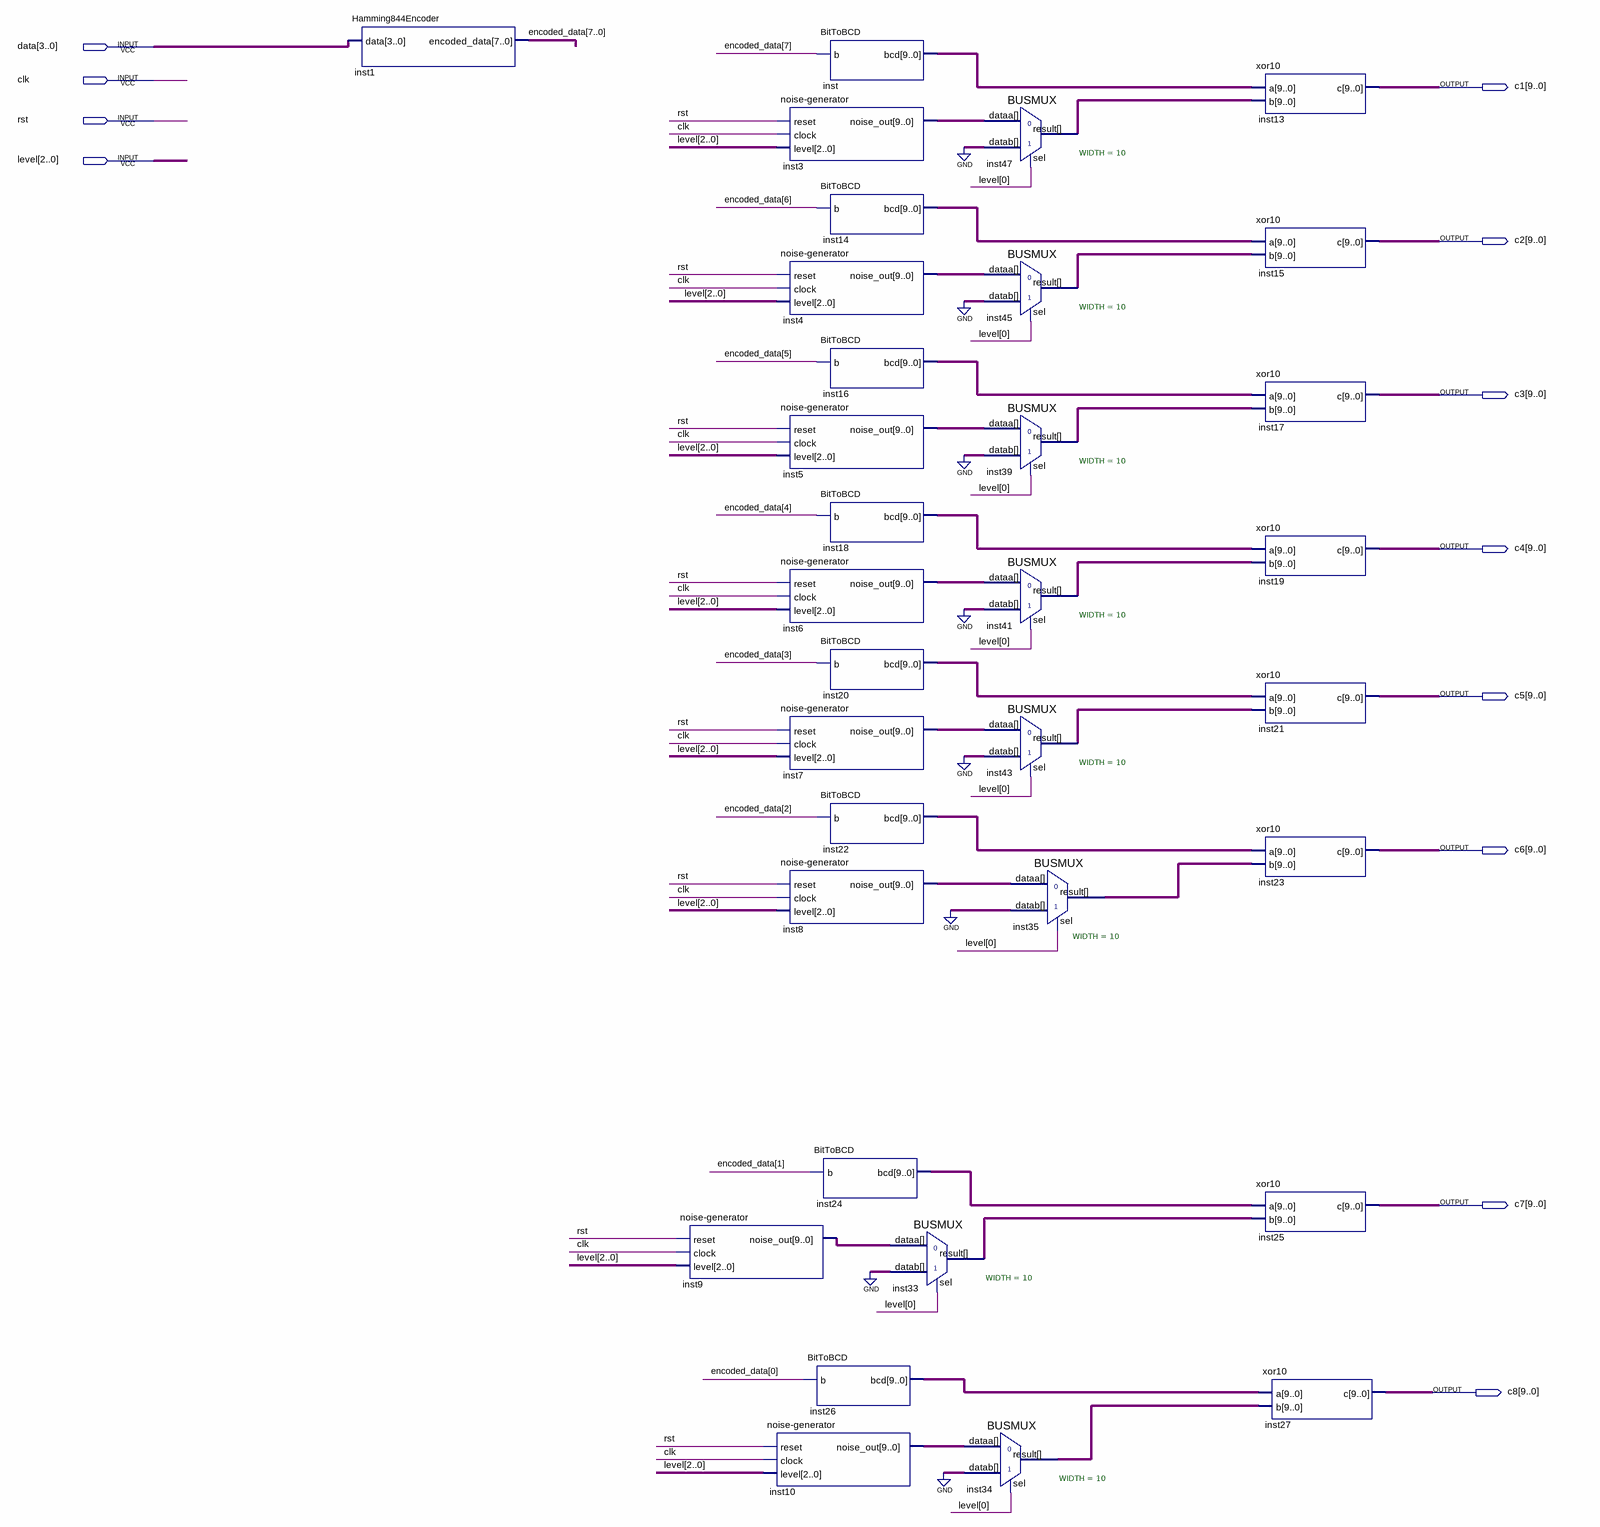
[diagram p0: schematic sheet]
// Quartus schematic make-signal.bdf as structural Verilog: 33 symbols, 12 pins
module \make-signal  (
  input  [3:0] data,
  input  clk,
  input  rst,
  input  [2:0] level,
  output [9:0] c1,
  output [9:0] c2,
  output [9:0] c3,
  output [9:0] c4,
  output [9:0] c5,
  output [9:0] c6,
  output [9:0] c7,
  output [9:0] c8
);

  wire [7:0] encoded_data;
  wire [9:0] inst3_noise_out, inst4_noise_out, inst5_noise_out, inst6_noise_out, inst7_noise_out,
       inst8_noise_out, inst9_noise_out, inst10_noise_out, inst14_bcd, inst16_bcd, inst18_bcd, inst20_bcd,
       inst22_bcd, inst24_bcd, inst26_bcd, inst33_result, inst34_result, inst35_result, inst39_result,
       inst41_result, inst43_result, inst45_result, inst47_result, inst_bcd;

  Hamming844Encoder inst1 (.data(data), .encoded_data(encoded_data));
  \noise-generator  inst9 (.reset(rst), .clock(clk), .level(level), .noise_out(inst9_noise_out));
  \noise-generator  inst3 (.reset(rst), .clock(clk), .level(level), .noise_out(inst3_noise_out));
  \noise-generator  inst4 (.reset(rst), .clock(clk), .level(level), .noise_out(inst4_noise_out));
  \noise-generator  inst5 (.reset(rst), .clock(clk), .level(level), .noise_out(inst5_noise_out));
  \noise-generator  inst6 (.reset(rst), .clock(clk), .level(level), .noise_out(inst6_noise_out));
  \noise-generator  inst7 (.reset(rst), .clock(clk), .level(level), .noise_out(inst7_noise_out));
  \noise-generator  inst8 (.reset(rst), .clock(clk), .level(level), .noise_out(inst8_noise_out));
  BitToBCD inst24 (.b(encoded_data[1]), .bcd(inst24_bcd));
  BitToBCD inst26 (.b(encoded_data[0]), .bcd(inst26_bcd));
  \noise-generator  inst10 (.reset(rst), .clock(clk), .level(level), .noise_out(inst10_noise_out));
  BitToBCD inst (.b(encoded_data[7]), .bcd(inst_bcd));
  BitToBCD inst14 (.b(encoded_data[6]), .bcd(inst14_bcd));
  BitToBCD inst16 (.b(encoded_data[5]), .bcd(inst16_bcd));
  BitToBCD inst18 (.b(encoded_data[4]), .bcd(inst18_bcd));
  BitToBCD inst20 (.b(encoded_data[3]), .bcd(inst20_bcd));
  BitToBCD inst22 (.b(encoded_data[2]), .bcd(inst22_bcd));
  BUSMUX #(.WIDTH(10)) inst33 (.datab({10{1'b0}}), .sel(level[0]), .dataa(inst9_noise_out), .result(inst33_result));
  BUSMUX #(.WIDTH(10)) inst34 (.datab({10{1'b0}}), .sel(level[0]), .dataa(inst10_noise_out), .result(inst34_result));
  BUSMUX #(.WIDTH(10)) inst47 (.datab({10{1'b0}}), .sel(level[0]), .dataa(inst3_noise_out), .result(inst47_result));
  BUSMUX #(.WIDTH(10)) inst45 (.datab({10{1'b0}}), .sel(level[0]), .dataa(inst4_noise_out), .result(inst45_result));
  BUSMUX #(.WIDTH(10)) inst39 (.datab({10{1'b0}}), .sel(level[0]), .dataa(inst5_noise_out), .result(inst39_result));
  BUSMUX #(.WIDTH(10)) inst41 (.datab({10{1'b0}}), .sel(level[0]), .dataa(inst6_noise_out), .result(inst41_result));
  BUSMUX #(.WIDTH(10)) inst43 (.datab({10{1'b0}}), .sel(level[0]), .dataa(inst7_noise_out), .result(inst43_result));
  BUSMUX #(.WIDTH(10)) inst35 (.datab({10{1'b0}}), .sel(level[0]), .dataa(inst8_noise_out), .result(inst35_result));
  xor10 inst13 (.a(inst_bcd), .b(inst47_result), .c(c1));
  xor10 inst15 (.a(inst14_bcd), .b(inst45_result), .c(c2));
  xor10 inst17 (.a(inst16_bcd), .b(inst39_result), .c(c3));
  xor10 inst19 (.a(inst18_bcd), .b(inst41_result), .c(c4));
  xor10 inst21 (.a(inst20_bcd), .b(inst43_result), .c(c5));
  xor10 inst23 (.a(inst22_bcd), .b(inst35_result), .c(c6));
  xor10 inst25 (.a(inst24_bcd), .b(inst33_result), .c(c7));
  xor10 inst27 (.a(inst26_bcd), .b(inst34_result), .c(c8));
endmodule
